# EAGLE design OSO-MISC-22-003 Ring Thing (EAGLE 9.6.2)
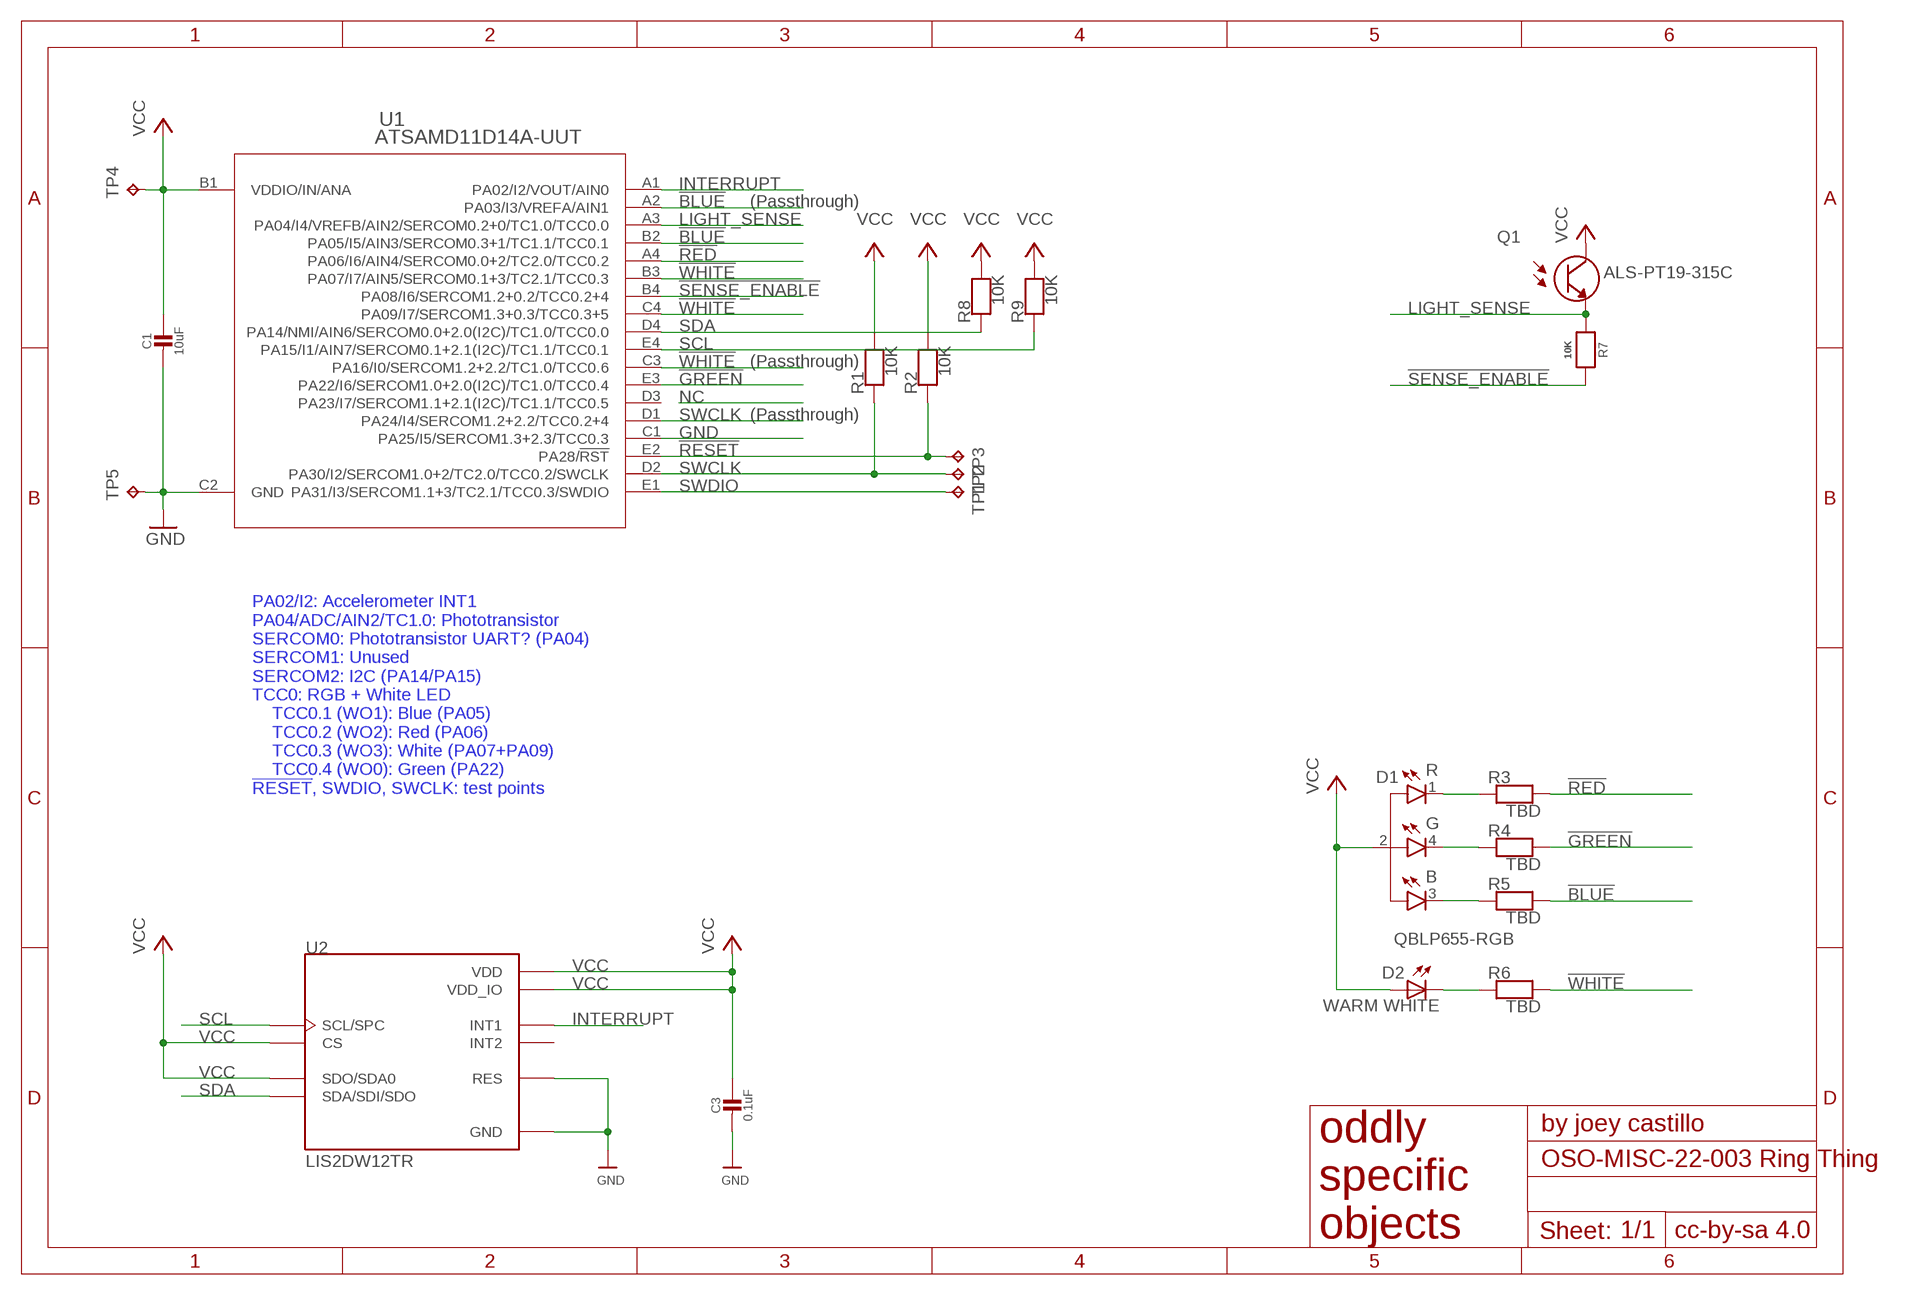
[diagram p0: schematic, sheet 1]

## Parts
C1  10uF  CAP_CERAMIC_0603MP  [_0603MP]
C3  0.1uF  CAP_CERAMIC_0402MP  [_0402MP]
D1  QBLP655-RGB  [LED_QBLP655]
D2  WARM WHITE  LEDCHIP-LED0603  [CHIP-LED0603]
Q1  ALS-PT19-315C  ALS-PT19-315C/L177/TR8  [XDCR_ALS-PT19-315C/L177/TR8]
R1  10K  RESISTOR_0402MP  [_0402MP]
R2  10K  RESISTOR_0402MP  [_0402MP]
R3  TBD  RESISTOR_0402MP  [_0402MP]
R4  TBD  RESISTOR_0402MP  [_0402MP]
R5  TBD  RESISTOR_0402MP  [_0402MP]
R6  TBD  RESISTOR_0402MP  [_0402MP]
R7  10K  RESISTOR_0402MP  [_0402MP]
R8  10K  RESISTOR_0402MP  [_0402MP]
R9  10K  RESISTOR_0402MP  [_0402MP]
TP1  TPTP10R  [TP10R]
TP2  TPTP10R  [TP10R]
TP3  TPTP10R  [TP10R]
TP4  TPTP12SQ  [TP12SQ]
TP5  TPTP20R  [TP20R]
U1  ATSAMD11D14A-UUT  [WLCSP20_2P4X1P9_MCH]
U2  LIS2DW12TR  [LGA12R50P4X4_200X200X70]

## Nets
!BLUE: R5.2 U1.A2(PA03/I3/VREFA/AIN1) U1.B2(PA05/I5/AIN3/SERCOM0.3+1/TC1.1/TCC0.1)
!GREEN: R4.2 U1.E3(PA22/I6/SERCOM1.0+2.0(I2C)/TC1.0/TCC0.4)
!RED: R3.2 U1.A4(PA06/I6/AIN4/SERCOM0.0+2/TC2.0/TCC0.2)
!RESET: R2.1 TP3.TP U1.E2(PA28/!RST)
!SENSE_ENABLE: R7.2 U1.B4(PA08/I6/SERCOM1.2+0.2/TCC0.2+4)
!WHITE: R6.2 U1.B3(PA07/I7/AIN5/SERCOM0.1+3/TC2.1/TCC0.3) U1.C3(PA16/I0/SERCOM1.2+2.2/TC1.0/TCC0.6) U1.C4(PA09/I7/SERCOM1.3+0.3/TCC0.3+5)
_BLUE: D1.3(CB) R5.1
_GREEN: D1.4(CG) R4.1
_RED: D1.1(CR) R3.1
_WHITE: D2.C R6.1
GND: C1.2 C3.2 TP5.TP U1.C1(PA25/I5/SERCOM1.3+2.3/TCC0.3) U1.C2(GND) U2.6(GND) U2.7(RES) U2.8(GND)
INTERRUPT: U1.A1(PA02/I2/VOUT/AIN0) U2.12(INT1)
LIGHT_SENSE: Q1.2(E) R7.1 U1.A3(PA04/I4/VREFB/AIN2/SERCOM0.2+0/TC1.0/TCC0.0)
SCL: R9.1 U1.E4(PA15/I1/AIN7/SERCOM0.1+2.1(I2C)/TC1.1/TCC0.1) U2.1(SCL/SPC)
SDA: R8.1 U1.D4(PA14/NMI/AIN6/SERCOM0.0+2.0(I2C)/TC1.0/TCC0.0) U2.4(SDA/SDI/SDO)
SWCLK: R1.1 TP2.TP U1.D1(PA24/I4/SERCOM1.2+2.2/TCC0.2+4) U1.D2(PA30/I2/SERCOM1.0+2/TC2.0/TCC0.2/SWCLK)
SWDIO: TP1.TP U1.E1(PA31/I3/SERCOM1.1+3/TC2.1/TCC0.3/SWDIO)
VCC: C1.1 C3.1 D1.2(A) D2.A Q1.1(C) R1.2 R2.2 R8.2 R9.2 TP4.TP U1.B1(VDDIO/IN/ANA) U2.2(CS) U2.3(SDO/SDA0) U2.9(VDD) U2.10(VDD_IO)
Unconnected: U1.D3(PA23/I7/SERCOM1.1+2.1(I2C)/TC1.1/TCC0.5) U2.11(INT2)

## Notes on the sheet
- (Passthrough)
- (Passthrough)
- (Passthrough)
- PA02/I2: Accelerometer INT1
  PA04/ADC/AIN2/TC1.0: Phototransistor
  SERCOM0: Phototransistor UART? (PA04)
  SERCOM1: Unused
  SERCOM2: I2C (PA14/PA15)
  TCC0: RGB + White LED
      TCC0.1 (WO1): Blue (PA05)
      TCC0.2 (WO2): Red (PA06)
      TCC0.3 (WO3): White (PA07+PA09)
      TCC0.4 (WO0): Green (PA22)
  !RESET, SWDIO, SWCLK: test points

## Library data of the parts
C1 C3 = microbuilder:CAP_CERAMIC: Ceramic Capacitors For new designs, use the packages preceded by an '_' character since they are more reliable: The following footprints should be used on most boards: _0402 - Standard footprint for regular board layouts _0603 - Standard footprint for regular board layouts _0805 - Standard footprint for regular board layouts _1206 - Standard footprint for regular board layouts For extremely tight-pitch boards where space is at a premium, the following 'micro-pitch' footprints can be used (smaller pads, no silkscreen outline, etc.): _0402MP - Micro-pitch footprint for very dense/compact boards _0603MP - Micro-pitch footprint for very dense/compact boards _0805MP - Micro-pitch footprint for very dense/compact boards _1206MP - Micro-pitch footprint for very dense/compact boards
D1 = QBLP655:QBLP655-RGB: Green, Red 571nm Green, 631nm Red LED Indication - Discrete 2V Green, 2V Red 1206 (3216 Metric); DESCRIPTION: Green, Red 571nm Green, 631nm Red LED Indication - Discrete 2V Green, 2V Red 1206 (3216 Metric); DIGI-KEY_PART_NUMBER: 160-2026-1-ND; MF: Lite-On Inc.; MP: LTST-C235KGKRKT; PACKAGE: 1206 Lite-On; PURCHASE-URL: https://pricing.snapeda.com/search/part/LTST-C235KGKRKT/?ref=eda
D2 = adafruit:LED: LED OSRAM: - CHIPLED LG R971, LG N971, LY N971, LG Q971, LY Q971, LO R971, LY R971 LH N974, LH R974 LS Q976, LO Q976, LY Q976 LO Q996 - Hyper CHIPLED LW Q18S LB Q993, LB Q99A, LB R99A - SideLED LS A670, LO A670, LY A670, LG A670, LP A670 LB A673, LV A673, LT A673, LW A673 LH A674 LY A675 LS A676, LA A676, LO A676, LY A676, LW A676 LS A679, LY A679, LG A679 - Hyper Micro SIDELED® LS Y876, LA Y876, LO Y876, LY Y876 LT Y87S - SmartLED LW L88C, LW L88S LB L89C, LB L89S, LG L890 LS L89K, LO L89K, LY L89K LS L896, LA L896, LO L896, LY L896 - TOPLED LS T670, LO T670, LY T670, LG T670, LP T670 LSG T670, LSP T670, LSY T670, LOP T670, LYG T670 LG T671, LOG T671, LSG T671 LB T673, LV T673, LT T673, LW T673 LH T674 LS T676, LA T676, LO T676, LY T676, LB T676, LH T676, LSB T676, LW T676 LB T67C, LV T67C, LT T67C, LS T67K, LO T67K, LY T67K, LW E67C LS E67B, LA E67B, LO E67B, LY E67B, LB E67C, LV E67C, LT E67C LW T67C LS T679, LY T679, LG T679 LS T770, LO T770, LY T770, LG T770, LP T770 LB T773, LV T773, LT T773, LW T773 LH T774 LS E675, LA E675, LY E675, LS T675 LS T776, LA T776, LO T776, LY T776, LB T776 LHGB T686 LT T68C, LB T68C - Hyper Mini TOPLED® LB M676 - Mini TOPLED Santana® LG M470 LS M47K, LO M47K, LY M47K Source: http://www.osram.convergy.de/
Q1 = ALS-PT19-315C_L177_TR8:ALS-PT19-315C/L177/TR8: Phototransistors 630nm 2-SMD, No Lead; DESCRIPTION: Phototransistors 630nm - 2-SMD, No Lead; DIGI-KEY_PART_NUMBER: 1080-1244-2-ND; MF: Everlight; MP: ALS-PT19-315C/L177/TR8; PACKAGE: SMD-2 Everlight Electronics Co Ltd; PURCHASE-URL: https://pricing.snapeda.com/search/part/ALS-PT19-315C/L177/TR8/?ref=eda
R1-R9 = microbuilder:RESISTOR: Resistors For new designs, use the packages preceded by an '_' character since they are more reliable: The following footprints should be used on most boards: _0402 - Standard footprint for regular board layouts _0603 - Standard footprint for regular board layouts _0805 - Standard footprint for regular board layouts _1206 - Standard footprint for regular board layouts For extremely tight-pitch boards where space is at a premium, the following 'micro-pitch' footprints can be used (smaller pads, no silkscreen outline, etc.): _0402MP - Micro-pitch footprint for very dense/compact boards _0603MP - Micro-pitch footprint for very dense/compact boards _0805MP - Micro-pitch footprint for very dense/compact boards _1206MP - Micro-pitch footprint for very dense/compact boards
TP1-TP5 = testpad:TP: Test pad
U1 = ATSAMD11D14A-UUT:ATSAMD11D14A-UUT; COPYRIGHT: Copyright (C) 2022 Ultra Librarian. All rights reserved.; DIGI-KEY_PART_NUMBER_1: 1611-ATSAMD11D14A-UUTCT-ND; DIGI-KEY_PART_NUMBER_2: ATSAMD11D14A-UUT-ND; MANUFACTURER_PART_NUMBER: ATSAMD11D14A-UUT; MFR_NAME: Microchip
U2 = LIS2DW12TR:LIS2DW12TR: Mems Digital Output Motion Sensor; DESCRIPTION: Accelerometer X, Y, Z Axis ±2g, 4g, 8g, 16g 400Hz 12-LGA (2x2); MF: STMicroelectronics; MP: LIS2DW12TR; PACKAGE: LGA-12 STMicroelectronics; PURCHASE-URL: https://pricing.snapeda.com/search/part/LIS2DW12TR/?ref=eda

## Net classes
1 power: width 0.203 mm
2 gnd: width 0.152 mm

## Board
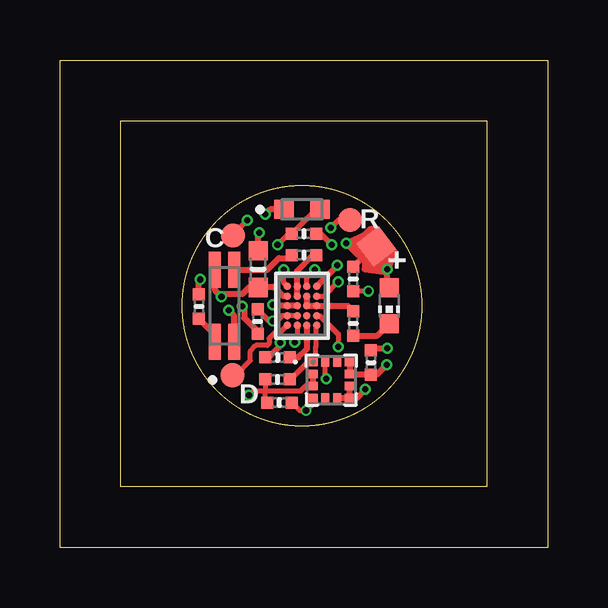
[diagram p1: board, top side]
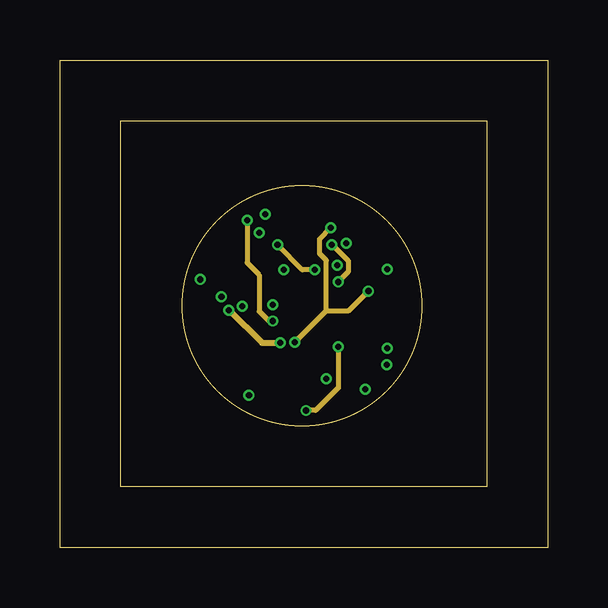
[diagram p2: board, inner layer Route2]
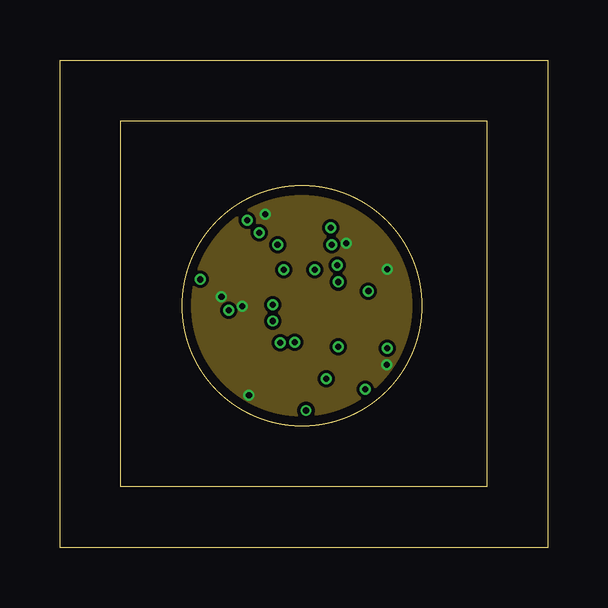
[diagram p3: board, inner layer Route3]
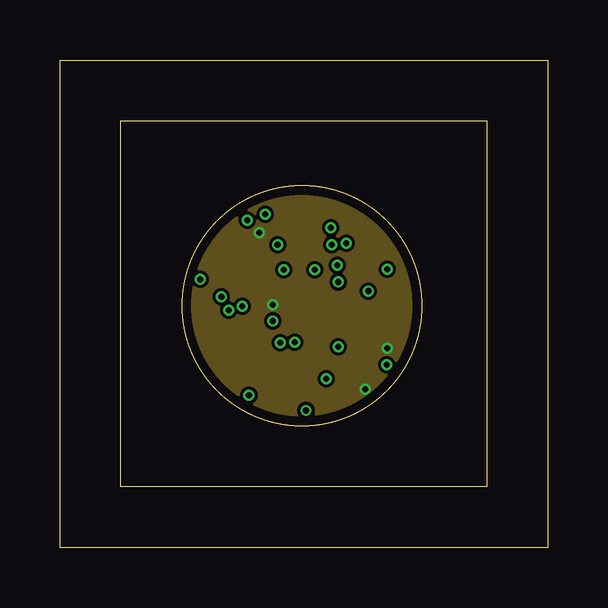
[diagram p4: board, inner layer Route14]
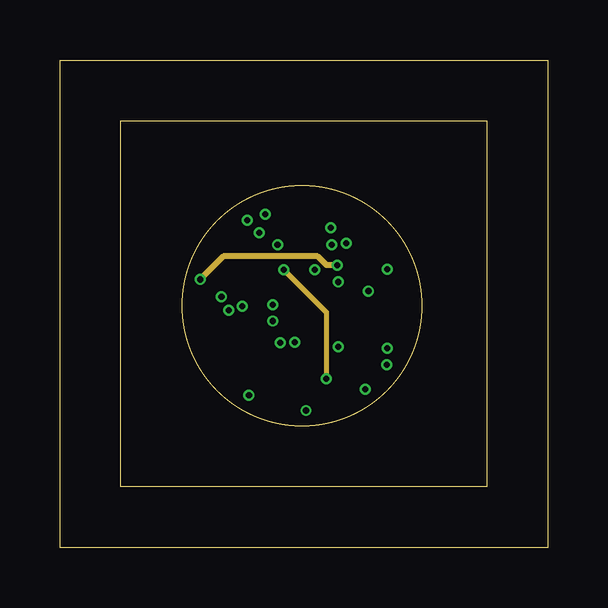
[diagram p5: board, inner layer Route15]
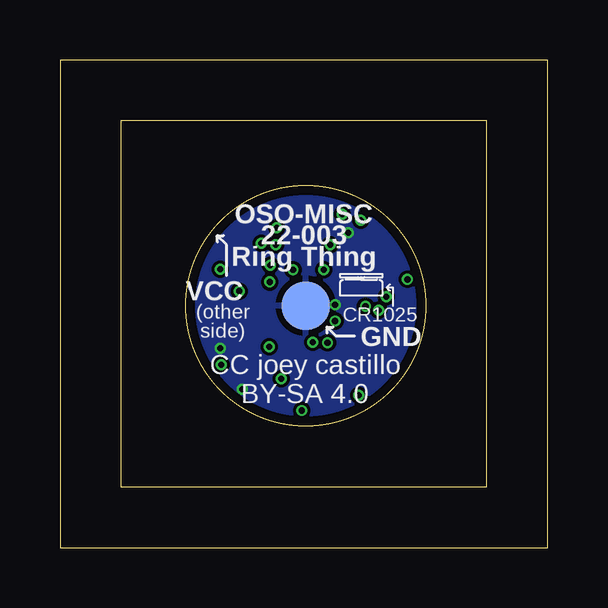
[diagram p6: board, bottom side, seen from below]

Size 20.32 x 20.32 mm. Coordinates in mm from the lower left corner, seen from the top.
Outline: 0,0 0,20.32 20.32,20.32 20.32,0 0,0
Outline: 2.54,2.54 2.54,17.78 17.78,17.78 17.78,2.54 2.54,2.54
Outline: circle at 10.08,10.08 radius 5
Copper layers (1*2*3*14*15*16): Top 0.04318125mm / dielectric 0.11074375mm / Route2 0.017271875mm / dielectric 4mil / Route3 0.017271875mm / dielectric 0.925575mm / Route14 0.017271875mm / dielectric 4mil / Route15 0.017271875mm / dielectric 0.11074375mm / Bottom 0.04318125mm
Design rules "oshpark-6layer *": minimum track width 5mil, minimum drill 10mil, track to track 5mil, track to pad 5mil, pad to pad 5mil, via to via 5mil, smd to smd 5mil, copper to edge 15mil, drill to drill 6mil, minimum pad ring 4mil, minimum via ring 4mil, stop-mask expansion 1.5mil, vias tented up to drill 10mil, thermal gap 10mil

### Footprints (pad centres in the part's own frame; a part is rotated, then mirrored left to right if it is on the bottom)
_0603MP = smd 0.8 x 0.8: 1 -0.762,0; 2 0.762,0
_0402MP = smd 0.5 x 0.5: 1 -0.508,0; 2 0.508,0
LED_QBLP655 = smd 1.5 x 0.5: 1 -1.5,0.4; 2 1.5,0.4; 3 1.5,-0.4; 4 -1.5,-0.4
CHIP-LED0603 = smd 0.8 x 0.8: A 0,-0.75; C 0,0.75
XDCR_ALS-PT19-315C/L177/TR8 = smd 0.8 x 0.8: 1 -0.75,0; 2 0.75,0
TP10R = smd 1 x 1: TP 0,0
TP12SQ = smd 1.2 x 1.2: TP 0,0
TP20R = smd 2 x 2: TP 0,0
WLCSP20_2P4X1P9_MCH = smd 0.305 x 0.305: A1 -0.61,0.813; A2 -0.203,0.813; A3 0.203,0.813; A4 0.61,0.813; B1 -0.61,0.406; B2 -0.203,0.406; B3 0.203,0.406; B4 0.61,0.406; C1 -0.61,0; C2 -0.203,0; C3 0.203,0; C4 0.61,0; D1 -0.61,-0.406; D2 -0.203,-0.406; D3 0.203,-0.406; D4 0.61,-0.406; E1 -0.61,-0.813; E2 -0.203,-0.813; E3 0.203,-0.813; E4 0.61,-0.813
LGA12R50P4X4_200X200X70 = smd 0.4 x 0.35: 1 -0.76,0.75; 2 -0.76,0.25; 3 -0.76,-0.25; 4 -0.76,-0.75; 7 0.76,-0.75; 8 0.76,-0.25; 9 0.76,0.25; 10 0.76,0.75 | smd 0.35 x 0.4: 5 -0.25,-0.76; 6 0.25,-0.76; 11 0.25,0.76; 12 -0.25,0.76

### Placement (x,y rotation side)
C1  8.26,11.6 90 top
C3  12.95,7.71 90 top
D1  6.86,10.08 90 top
D2  13.72,10.08 180 top
Q1  10.08,14.1 0 top
R1  8.23,9.42 270 top
R2  12.22,11.2 90 top
R3  5.79,10.05 90 top
R4  9.07,7.92 0 top
R5  10.16,12.19 0 top
R6  12.22,9.35 90 top
R7  10.16,13.08 0 top
R8  9.14,6.05 180 top
R9  9.07,7.01 180 top
TP1  7.18,7.18 0 top
TP2  7.21,13 0 top
TP3  12.09,13.66 0 top
TP4  13.18,12.54 37.5 top
TP5  10.08,10.08 0 bottom
U1  10.08,10.08 0 top
U2  11.3,6.99 0 top

### Tracks (layer width: path | path; a pad name or v marks a point on that pad's centre or on a via)
!BLUE
  Top 0.254: U1.B2 U1.A2 9.88,11.53 10.54,12.19 R5.2
!GREEN
  Top 0.254: U1.E3 10.28,8.28 9.93,7.92 R4.2
!RED  (via drill 0.25)
  Top 0.254: R3.2 5.79,11.12 v5.84,11.18 | U1.A4 11.55,11.76 v11.55,11.77
  Route15 0.254: v5.84,11.18 6.8,12.14 10.74,12.14 11.1,11.77 v11.55,11.77
!RESET  (via drill 0.25)
  Top 0.203: U1.E2 9.88,8.65 v9.78,8.56 | TP3.TP 11.62,13.66 v11.29,13.33 | v12.85,10.69 R2.1
  Route2 0.203: v9.78,8.56 11.1,9.87 | 11.1,9.87 11.1,11.97 10.82,12.25 10.82,12.86 v11.29,13.33 | 11.1,9.87 12.03,9.87 v12.85,10.69
!SENSE_ENABLE  (via drill 0.25)
  Top 0.203: U1.B4 11,10.49 v11.59,11.07 | v11.32,12.62 10.86,13.08 R7.2
  Route2 0.203: v11.59,11.07 12.02,11.5 12.02,11.95 11.35,12.62 v11.32,12.62
!WHITE
  Top 0.254: U1.B3 U1.C3 U1.C4 11.99,10.08 R6.2
_BLUE
  Top 0.254: D1.3 8.63,11.58 9.12,12.07 9.53,12.07 R5.1
_GREEN  (via drill 0.25)
  Top 0.254: D1.4 7.23,8.61 7.23,9.69 v7.03,9.89 | v9.17,8.53 9.17,8.4 8.7,7.92 R4.1
  Route2 0.254: v9.17,8.53 8.42,8.53 7.06,9.89 v7.03,9.89
_RED
  Top 0.254: R3.1 6.46,8.88 D1.1
_WHITE
  Top 0.254: R6.1 13.22,8.84 D2.C
GND  (via drill 0.25)
  Top 0.254: C1.2 8.26,13.08 v8.3,13.13 | U1.C2 U1.C1 8.9,10.08 v8.86,10.12 | C3.2 13.04,8.3 v13.64,8.3 | U2.7 U2.8 | U2.7 12.05,6.22 U2.6 | U2.7 12.36,6.24 v12.72,6.6
  pour Route14: 5.08,10.08 arc-90 10.08,15.08 arc-90 15.08,10.08 arc-90 10.08,5.08 arc-90
  pour Bottom: 5.08,10.08 arc-90 10.08,15.08 arc-90 15.08,10.08 arc-90 10.08,5.08 arc-90
INTERRUPT  (via drill 0.25)
  Top 0.203: U1.A1 9.32,11.04 v9.32,11.59 | v11.1,7.03 11.05,7.08 U2.12
  Route15 0.203: v9.32,11.59 11.1,9.81 v11.1,7.03
LIGHT_SENSE  (via drill 0.25)
  Top 0.203: Q1.2 10.67,14.1 R7.1 9.53,13.08 v9.06,12.62 | U1.A3 10.28,11.25 v10.61,11.58
  Route2 0.203: v10.61,11.58 10.1,11.58 v9.06,12.62
SCL
  Top 0.203: U1.E4 10.66,9.24 10.66,8.38 10.64,8.36 10.64,7.84 U2.1 | U2.1 | U2.1 10.35,7.74 9.62,7.01 R9.1
SDA  (via drill 0.25)
  Top 0.203: U1.D4 10.71,9.65 10.85,9.65 11.6,8.9 v11.6,8.38 | U2.4 10.54,5.98 10.28,5.72 v10.25,5.72 9.98,5.72 R8.1
  Route2 0.203: v11.6,8.38 11.6,6.66 10.66,5.72 v10.25,5.72
SWCLK  (via drill 0.25)
  Top 0.203: R1.1 8.71,9.45 v8.86,9.45 9.04,9.45 9.27,9.67 U1.D1 U1.D2 | TP2.TP 7.21,13.05 v7.79,13.64
  Route2 0.203: v7.79,13.64 7.79,11.88 8.3,11.37 8.3,9.85 8.71,9.45 v8.86,9.45
SWDIO
  Top 0.203: TP1.TP 7.31,7.18 7.93,7.8 7.93,8.19 8.16,8.43 8.64,8.43 8.72,8.51 8.72,8.72 8.98,8.99 9.19,8.99 U1.E1
VCC  (via drill 0.25)
  Top 0.203: v7.87,6.35 8.05,6.52 8.56,6.52 | 8.56,6.52 10.01,6.52 10.22,6.74 U2.3 | R9.2 8.56,6.52 | R8.2 8.56,6.12 8.56,6.52
  Top 0.254: Q1.1 8.76,14.1 v8.56,13.89 | U2.3 U2.2 | U2.10 U2.9 12.93,7.24 C3.1 13.2,7.21 v13.61,7.62 | U1.B1 9.3,10.49 8.95,10.84 C1.1 7.88,10.84 7.61,10.58 6.84,10.58 v6.73,10.46 6.46,10.73 D1.2 | D2.A 13.64,10.91 13.64,11.48 | 13.64,11.48 v13.64,11.6 | R1.2 8.23,9.02 7.67,9.58 7.67,9.99 v7.59,10.07 | 13.64,12.09 TP4.TP 13.15,12.57 12.24,12.57 | v13.64,11.6 13.64,12.09 | 12.24,12.57 12.04,12.57 v11.93,12.68 | 12.24,12.57 12.65,12.08 | 12.65,12.08 13.04,11.62 | 13.04,11.62 13.64,12.09 | 12.24,12.57 12.52,12.85 | 12.52,12.85 12.75,13.08 | 12.75,13.08 12.95,13.28 13.19,13.28 | v11.93,12.68 12.43,12.19 12.55,12.19 12.7,12.04 12.7,11.6 | v11.93,12.68 12.52,12.85 | v11.93,12.68 12.75,13.08 | 13.64,12.09 13.73,12.09 13.84,12.2 | 13.84,12.2 13.96,12.32 v13.64,11.6 | 13.84,12.2 13.64,11.48 | v13.64,11.6 13.4,11.9 | v13.64,11.6 13.38,11.61 | 13.38,11.61 13.04,11.62 | 12.7,11.6 12.87,11.61 13.38,11.61 | 12.7,11.6 13.64,11.48 | R2.2 12.59,12.08 12.65,12.08
  pour Route3: 5.08,10.08 arc-90 10.08,15.08 arc-90 15.08,10.08 arc-90 10.08,5.08 arc-90

### Text on the board
tPlace: R | C | + | D
bPlace: OSO-MISC / 22-003 / Ring Thing | VCC | CR1025 | GND | (other / side) | CC joey castillo / BY-SA 4.0